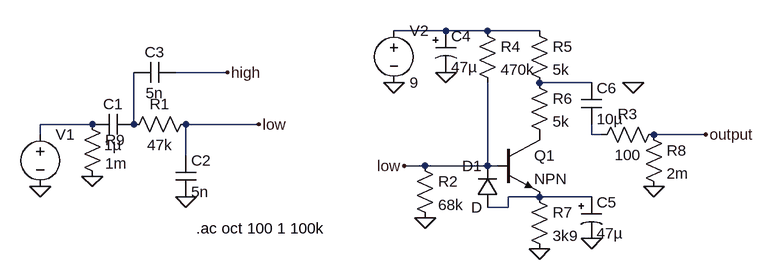
[diagram p0: schematic Draft5.asc]
Draft5.asc, the LTspice schematic file:
Version 4
SHEET 1 1048 680
WIRE 560 112 480 112
WIRE 624 112 560 112
WIRE 704 112 624 112
WIRE 224 176 144 176
WIRE 784 192 704 192
WIRE 16 256 -64 256
WIRE 80 256 80 176
WIRE 272 256 160 256
WIRE -64 272 -64 256
WIRE 784 272 784 256
WIRE 800 272 784 272
WIRE 960 272 880 272
WIRE 160 304 160 256
WIRE 528 320 496 320
WIRE 624 320 624 192
WIRE 624 320 528 320
WIRE 640 320 624 320
WIRE 704 368 656 368
WIRE 784 368 704 368
WIRE 656 384 656 368
WIRE 656 384 624 384
FLAG -64 352 0
FLAG 160 368 0
FLAG 272 256 low
FLAG 224 176 high
FLAG 480 192 0
FLAG 704 448 0
FLAG 784 432 0
FLAG 880 352 0
FLAG 560 176 0
FLAG 960 272 output
FLAG 16 336 0
FLAG 496 320 low
FLAG 528 400 0
FLAG 848 192 0
SYMBOL voltage -64 256 R0
SYMATTR InstName V1
SYMATTR Value ""
SYMATTR Value2 AC 1
SYMBOL cap 80 240 R90
WINDOW 0 0 32 VBottom 2
WINDOW 3 32 32 VTop 2
SYMATTR InstName C1
SYMATTR Value 1µ
SYMBOL res 176 240 R90
WINDOW 0 0 56 VBottom 2
WINDOW 3 32 56 VTop 2
SYMATTR InstName R1
SYMATTR Value 47k
SYMBOL cap 144 304 R0
SYMATTR InstName C2
SYMATTR Value 5n
SYMBOL cap 144 160 R90
WINDOW 0 0 32 VBottom 2
WINDOW 3 32 32 VTop 2
SYMATTR InstName C3
SYMATTR Value 5n
SYMBOL voltage 480 96 R0
SYMATTR InstName V2
SYMATTR Value 9
SYMBOL polcap 544 112 R0
SYMATTR InstName C4
SYMATTR Value 47µ
SYMBOL res 608 96 R0
SYMATTR InstName R4
SYMATTR Value 470k
SYMBOL res 688 96 R0
SYMATTR InstName R5
SYMATTR Value 5k
SYMBOL res 688 176 R0
SYMATTR InstName R6
SYMATTR Value 5k
SYMBOL npn 640 272 R0
SYMATTR InstName Q1
SYMBOL res 688 352 R0
SYMATTR InstName R7
SYMATTR Value 3k9
SYMBOL polcap 768 368 R0
SYMATTR InstName C5
SYMATTR Value 47µ
SYMBOL diode 640 384 R180
WINDOW 0 24 64 Left 2
WINDOW 3 24 0 Left 2
SYMATTR InstName D1
SYMBOL res 864 256 R0
SYMATTR InstName R8
SYMATTR Value 2m
SYMBOL res 0 240 R0
SYMATTR InstName R9
SYMATTR Value 1m
SYMBOL res 512 304 R0
SYMATTR InstName R2
SYMATTR Value 68k
SYMBOL cap 768 192 R0
SYMATTR InstName C6
SYMATTR Value 10µ
SYMBOL res 896 256 R90
WINDOW 0 0 56 VBottom 2
WINDOW 3 32 56 VTop 2
SYMATTR InstName R3
SYMATTR Value 100
TEXT 176 416 Left 2 !.ac oct 100 1 100k

The netlist it stands for:
* Draft5.asc
V1 N003 0 AC 1
C1 N004 N003 1µ
R1 low N004 47k
C2 low 0 5n
C3 high N004 5n
V2 N001 0 9
C4 N001 0 47µ
R4 N001 low 470k
R5 N001 N002 5k
R6 N002 P001 5k
Q1 P001 low N006 0 NPN
R7 N006 0 3k9
C5 N006 0 47µ
D1 N006 low D
R8 output 0 2m
R9 N003 0 1m
R2 low 0 68k
C6 N002 N005 10µ
R3 output N005 100
.model D D
.lib standard.dio
.model NPN NPN
.model PNP PNP
.lib standard.bjt
.ac oct 100 1 100k
.backanno
.end